# EAGLE design ATTiny10_Breadboard (EAGLE 9.6.2)
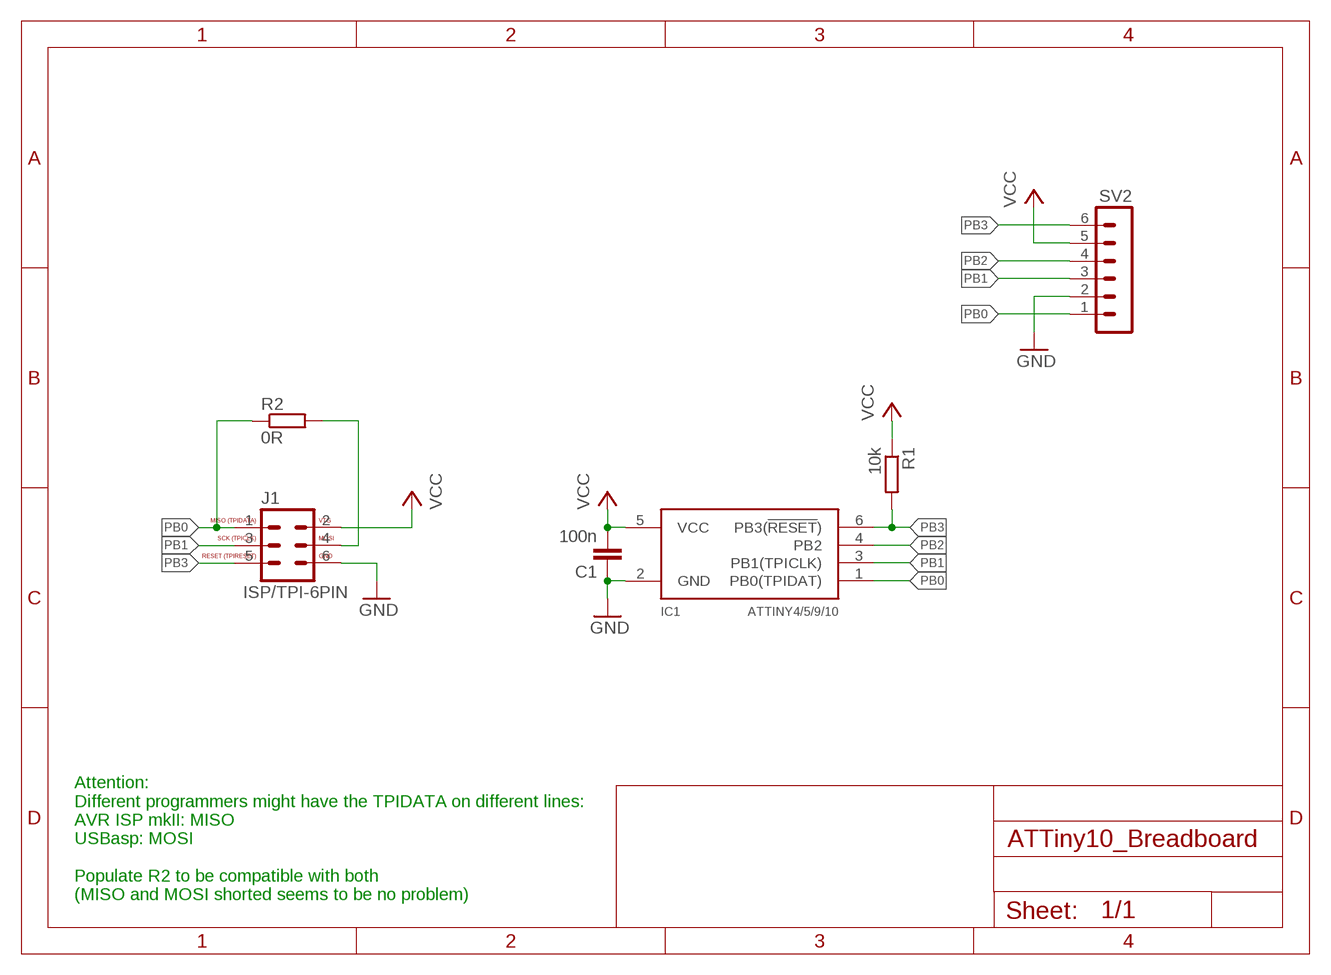
[diagram p0: schematic, sheet 1]

## Parts
C1  100n  C-EUC0402  [C0402]
IC1  ATTINY4/5/9/10  [SOT23-6]
J1  ISP/TPI-6PIN  [ML6]
R1  10k  R-EU_R0402  [R0402]
R2  0R  R-EU_R0402  [R0402]
SV2  MA06-1  [MA06-1]

## Nets
GND: C1.1 IC1.2(GND) J1.6 SV2.2
N$1: J1.4 R2.2
PB0: IC1.1(PB0(TPIDAT)) J1.1 R2.1 SV2.1
PB1: IC1.3(PB1(TPICLK)) J1.3 SV2.3
PB2: IC1.4(PB2) SV2.4
PB3: IC1.6(PB3(!RESET!)) J1.5 R1.2 SV2.6
VCC: C1.2 IC1.5(VCC) J1.2 R1.1 SV2.5

## Notes on the sheet
- Attention:
  Different programmers might have the TPIDATA on different lines:
  AVR ISP mkII: MISO
  USBasp: MOSI
  
  Populate R2 to be compatible with both
  (MISO and MOSI shorted seems to be no problem)

## Library data of the parts
C1 = rcl:C-EU: CAPACITOR, European symbol; SPICEPREFIX: C
IC1 = Eigene-Rietig:ATTINY4/5/9/10
J1 = Eigene-Rietig:ISP/TPI-6PIN: 6 poliger ISP/TPI-Anschluss für AVRs
R1 R2 = rcl:R-EU_: RESISTOR, European symbol; SPICEPREFIX: R
SV2 = con-lstb:MA06-1: PIN HEADER; OC_FARNELL: unknown; OC_NEWARK: unknown

## Board
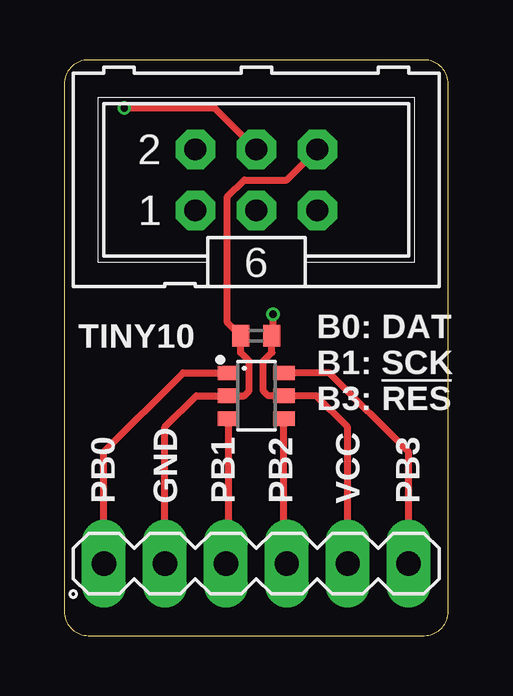
[diagram p1: board, top side]
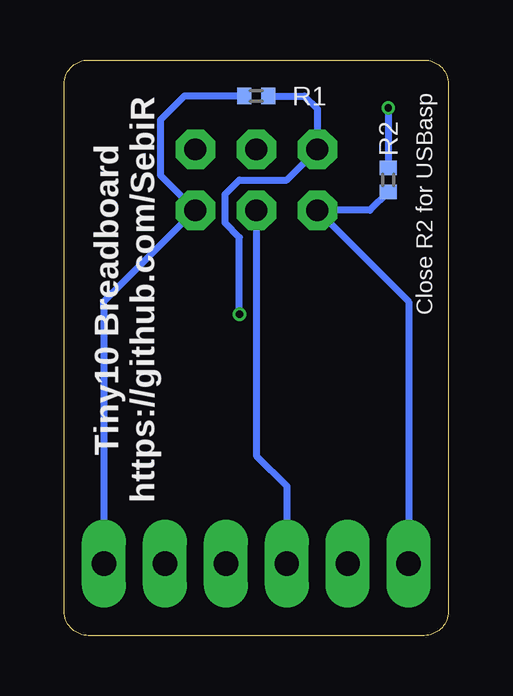
[diagram p2: board, bottom side, seen from below]

Size 16 x 24 mm. Coordinates in mm from the lower left corner, seen from the top.
Outline: 15,24 1,24 arc90 0,23 0,1 arc90 1,0 15,0 arc90 16,1 16,23 arc90 15,24
Copper layers (1*16): Top 0.035mm / dielectric 1.6mm / Bottom 0.035mm
Design rules "jlcpcb-2layers": minimum track width 0.2mm, minimum drill 0.3mm, track to track 5mil, track to pad 5mil, pad to pad 5mil, via to via 5mil, smd to smd 5mil, copper to edge 0.2mm, drill to drill 6mil, minimum pad ring 10mil, minimum via ring 0.125mm, stop-mask expansion 4mil, vias tented up to drill 0.5mm, thermal gap 10mil

### Footprints (pad centres in the part's own frame; a part is rotated, then mirrored left to right if it is on the bottom)
C0402 = smd 0.7 x 0.9: 1 -0.65,0; 2 0.65,0
SOT23-6 = smd 0.6 x 0.9: 1 -0.95,-1.15; 2 0,-1.15; 3 0.95,-1.15; 4 0.95,1.15; 5 0,1.15; 6 -0.95,1.15
ML6 = drill 0.914 octagon: 1 -2.54,-1.27; 2 -2.54,1.27; 3 0,-1.27; 4 0,1.27; 5 2.54,-1.27; 6 2.54,1.27
R0402 = smd 0.6 x 0.7: 1 -0.5,0; 2 0.5,0
MA06-1 = drill 1.016 long: 1 -6.35,0; 2 -3.81,0; 3 -1.27,0; 4 1.27,0; 5 3.81,0; 6 6.35,0

### Placement (x,y rotation side)
C1  8,12.5 0 top
IC1  8,10 270 top
J1  8,19 0 top
R1  8,22.5 180 bottom
R2  2.5,19 90 bottom
SV2  8,3 0 top

### Tracks (layer width: path | path; a pad name or v marks a point on that pad's centre or on a via)
GND
  Top 0.3: SV2.2 4.19,8.69 5.5,10 IC1.2 | IC1.2 6.95,9.9 | IC1.2 7.5,10 7.7,10.2 7.7,11.45 7.35,11.8 C1.1 6.8,13.05 6.8,18.3 7.5,19 9.27,19 J1.6
N$1  (via drill 0.3)
  Top 0.3: J1.4 6.27,22 v2.5,22
  Bottom 0.3: v2.5,22 R2.2
PB0
  Top 0.3: IC1.1 4.95,10.95 1.65,7.65 SV2.1
  Bottom 0.3: SV2.1 1.65,13.92 J1.1 3.27,17.73 R2.1
PB1
  Top 0.3: SV2.3 6.85,3.12 IC1.3
  Bottom 0.3: J1.3 8,7.5 6.73,6.23 SV2.3
PB2
  Top 0.3: SV2.4 9.15,3.12 IC1.4
PB3
  Top 0.3: IC1.6 11.05,10.95 14.35,7.65 SV2.6
  Bottom 0.3: SV2.6 14.35,13.5 14.35,13.65 14.35,13.92 J1.5 12,19.19 12,21.5 11,22.5 R1.2
VCC  (via drill 0.3)
  Top 0.3: SV2.5 11.81,8.69 10.5,10 IC1.5 | IC1.5 9.05,9.9 | IC1.5 8.5,10 8.3,10.2 8.3,11.45 8.65,11.8 C1.2 | C1.2 8.65,12.65 | C1.2 8.7,12.55 v8.7,13.4
  Bottom 0.3: v8.7,13.4 8.7,16.6 9.3,17.2 9.3,18.4 8.7,19 6.73,19 J1.2 5.46,21.96 6,22.5 R1.1

### Text on the board
tPlace: TINY10 | B0: DAT / B1: SCK / B3: !RES! | PB0 | GND | PB1 | PB2 | VCC | PB3
bPlace: Close R2 for USBasp | Tiny10 Breadboard / https://github.com/SebiR